# Altium schematic sheet koosh_mcu.SchDoc
size A
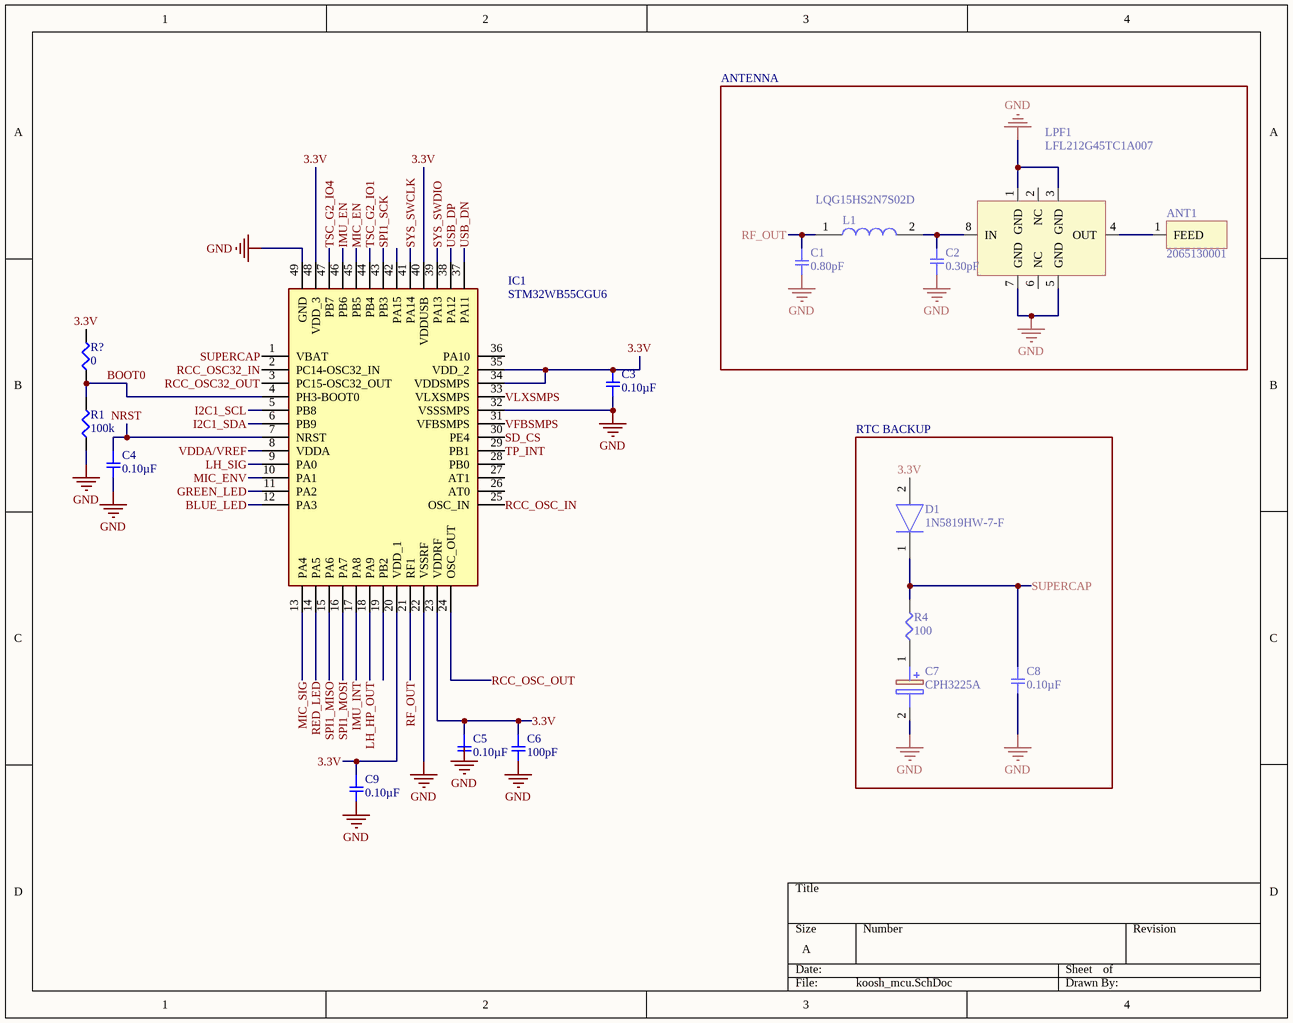
[diagram p0: koosh_mcu.SchDoc]

## Parts
ANT1  2065130001  [2065130001]
C1  0.80pF  [SMD-0402C]
C2  0.30pF  [SMD-0402C]
C3  0.10µF  [SMD-0402C]
C4  0.10µF  [SMD-0402C]
C5  0.10µF  [SMD-0402C]
C6  100pF  [SMD-0402C]
C7  CPH3225A  [CPH3225A]
C8  0.10µF  [SMD-0402C]
C9  0.10µF  [SMD-0402C]
D1  1N5819HW-7-F  [SOD3716X145N]
IC1  STM32WB55CGU6  [QFN50P700X700X65-49N-D]
L1  LQG15HS2N7S02D  [INDC1005X55N]
LPF1  LFL212G45TC1A007  [LFL212G45TC1A007]
R1  100k  [SMD-0402-RES]
R4  100  [SMD-0402-RES]
R?  0  [SMD-0402-RES]

## Blocks framed on the sheet
ANTENNA: ANT1 C1 C2 L1 LPF1
RTC BACKUP: C7 C8 D1 R4

## Nets
GND: C1.2 C2.1 C3.2 C4.2 C6.2 C7.2(-) C8.2 C9.2 IC1.22(VSSRF) IC1.32(VSSSMPS) IC1.49(GND) LPF1.1(GND) LPF1.3(GND) LPF1.5(GND) LPF1.7(GND) R1.1
3.3V: C3.1 C5.1 C6.1 C9.1 D1.2(A) IC1.20(VDD_1) IC1.23(VDDRF) IC1.34(VDDSMPS) IC1.35(VDD_2) IC1.40(VDDUSB) IC1.48(VDD_3) R?.2
BLUE_LED: IC1.12(PA3)
BOOT0: IC1.4(PH3-BOOT0) R1.2 R?.1
GREEN_LED: IC1.11(PA2)
I2C1_SCL: IC1.5(PB8)
I2C1_SDA: IC1.6(PB9)
IMU_EN: IC1.46(PB6)
IMU_INT: IC1.17(PA8)
LH_HP_OUT: IC1.18(PA9)
LH_SIG: IC1.9(PA0)
MIC_EN: IC1.45(PB5)
MIC_ENV: IC1.10(PA1)
MIC_SIG: IC1.13(PA4)
NRST: C4.1 IC1.7(NRST)
RCC_OSC32_IN: IC1.2(PC14-OSC32_IN)
RCC_OSC32_OUT: IC1.3(PC15-OSC32_OUT)
RCC_OSC_IN: IC1.25(OSC_IN)
RCC_OSC_OUT: IC1.24(OSC_OUT)
RED_LED: IC1.14(PA5)
RF_OUT: C1.1 IC1.21(RF1) L1.1
SD_CS: IC1.30(PE4)
SPI1_MISO: IC1.15(PA6)
SPI1_MOSI: IC1.16(PA7)
SPI1_SCK: IC1.43(PB3)
SUPERCAP: C8.1 D1.1(K) IC1.1(VBAT) R4.2
SYS_SWCLK: IC1.41(PA14)
SYS_SWDIO: IC1.39(PA13)
TP_INT: IC1.29(PB1)
TSC_G2_IO1: IC1.44(PB4)
TSC_G2_IO4: IC1.47(PB7)
USB_DN: IC1.37(PA11)
USB_DP: IC1.38(PA12)
VDDA/VREF: IC1.8(VDDA)
VFBSMPS: IC1.31(VFBSMPS)
VLXSMPS: IC1.33(VLXSMPS)
NetANT1_1: ANT1.1(FEED) LPF1.4(OUT)
NetC2_2: C2.2 L1.2 LPF1.8(IN)
NetC7_1: C7.1(+) R4.1

Not connected (* = marked no-connect by the designer): C5 2; IC1 19(PB2) 26(AT0) 27(AT1) 28(PB0) 36(PA10) 42(PA15); LPF1 2(NC) 6(NC)

## Notes on the sheet
- Labels drawn without touching a wire or pin: GND

## Library data of the parts
C1 = GRM1555C1HR80BA01D: CAP CER 0.8PF 50V NP0 0402; Manufacturer: Murata Electronics North America; Factory Stock: 0; Unit Price (USD): 0.1; Minimum Quantity: 1; Tolerance: ±0.1pF; Temperature Coefficient: C0G, NP0; Datasheets: http://www.murata.com/~/media/webrenewal/support/library/catalog/products/capacitor/mlcc/c02e.pdf; Image: //media.digikey.com/Renders/Murata%20Renders/ZRB-SERIES-0402.jpg; Digi-Key Part Number: 490-6269-1-ND; Part Number: GRM1555C1HR80BA01D; Quantity Available: 38847; @ qty: 0; Packaging: Cut Tape (CT); Series: GRM; Part Status: Active; Value: 0.80pF; Voltage: 50V; Operating Temperature: -55°C ~ 125°C; Features: -; Ratings: -; Applications: General Purpose; Mounting Type: Surface Mount, MLCC; Package / Case: 0402 (1005 Metric); Size / Dimension: 0.039" L x 0.020" W (1.00mm x 0.50mm); Height - Seated (Max): -; Thickness (Max): 0.022" (0.55mm); Lead Spacing: -; Lead Style: -
C2 = GRM1555C1HR30WA01D: CAP CER 0.3PF 50V NP0 0402; Manufacturer: Murata Electronics North America; Factory Stock: 0; Unit Price (USD): 0.16; Minimum Quantity: 1; Tolerance: ±0.05pF; Temperature Coefficient: C0G, NP0; Datasheets: http://www.murata.com/~/media/webrenewal/support/library/catalog/products/capacitor/mlcc/c02e.pdf; Image: //media.digikey.com/Renders/Murata%20Renders/ZRB-SERIES-0402.jpg; Digi-Key Part Number: 490-6261-1-ND; Part Number: GRM1555C1HR30WA01D; Quantity Available: 61475; @ qty: 0; Packaging: Cut Tape (CT); Series: GRM; Part Status: Active; Value: 0.30pF; Voltage: 50V; Operating Temperature: -55°C ~ 125°C; Features: -; Ratings: -; Applications: General Purpose; Mounting Type: Surface Mount, MLCC; Package / Case: 0402 (1005 Metric); Size / Dimension: 0.039" L x 0.020" W (1.00mm x 0.50mm); Height - Seated (Max): -; Thickness (Max): 0.022" (0.55mm); Lead Spacing: -; Lead Style: -
C3-C5 C8 C9 = GCM155R71C104KA55D: CAP CER 0.1UF 16V X7R 0402; Manufacturer: Murata Electronics North America; Factory Stock: 0; Unit Price (USD): 0.1; Minimum Quantity: 1; Tolerance: ±10%; Datasheets: http://www.murata.com/~/media/webrenewal/support/library/catalog/products/capacitor/mlcc/c03e.ashx; Image: //media.digikey.com/Renders/Murata%20Renders/ZRB-SERIES-0402.jpg; Digi-Key Part Number: 490-4759-1-ND; Part Number: GCM155R71C104KA55D; Quantity Available: 734194; @ qty: 0; Packaging: Cut Tape (CT); Series: GCM; Part Status: Active; Value: 0.10µF; Voltage: 16V; Temperature Coefficient: X7R; Operating Temperature: -55°C ~ 125°C; Features: -; Ratings: AEC-Q200; Applications: Automotive; Mounting Type: Surface Mount, MLCC; Package / Case: 0402 (1005 Metric); Size / Dimension: 0.039" L x 0.020" W (1.00mm x 0.50mm); Height - Seated (Max): -; Thickness (Max): 0.022" (0.55mm); Lead Spacing: -; Lead Style: -
C6 = GCM1555C1H101JA16D: CAP CER 100PF 50V NP0 0402; Manufacturer: Murata Electronics North America; Factory Stock: 0; Unit Price (USD): 0.1; Minimum Quantity: 1; Tolerance: ±5%; Temperature Coefficient: C0G, NP0; Datasheets: http://www.murata.com/~/media/webrenewal/support/library/catalog/products/capacitor/mlcc/c03e.ashx; Image: //media.digikey.com/Renders/Murata%20Renders/ZRB-SERIES-0402.jpg; Digi-Key Part Number: 490-10669-1-ND; Part Number: GCM1555C1H101JA16D; Quantity Available: 61397; @ qty: 0; Packaging: Cut Tape (CT); Series: GCM; Part Status: Active; Value: 100pF; Voltage: 50V; Operating Temperature: -55°C ~ 125°C; Features: -; Ratings: AEC-Q200; Applications: Automotive; Mounting Type: Surface Mount, MLCC; Package / Case: 0402 (1005 Metric); Size / Dimension: 0.039" L x 0.020" W (1.00mm x 0.50mm); Height - Seated (Max): -; Thickness (Max): 0.022" (0.55mm); Lead Spacing: -; Lead Style: -
C7 = CPH3225A: Capacitor Polarised; Manufacturer_Name: Seiko Instruments Micro Energy; Datasheet Link: https://www.sii.co.jp/en/me/datasheets/chip-capacitor/cph3225a/; Height: 1mm; Manufacturer_Part_Number: CPH3225A; Mouser Part Number: 628-CPH3225A; Mouser Price/Stock: https://www.mouser.com/Search/Refine.aspx?Keyword=628-CPH3225A
D1 = 1N5819HW-7-F: Diode; Manufacturer_Name: Diodes Inc.; Allied_Number: 70437201; Datasheet Link: http://www.diodes.com/_files/datasheets/ds30217.pdf; Height: 1.45mm; Manufacturer_Part_Number: 1N5819HW-7-F; Mouser Part Number: 621-1N5819HW-F; Mouser Price/Stock: https://www.mouser.com/Search/Refine.aspx?Keyword=621-1N5819HW-F; RS Part Number: 7082197P; RS Price/Stock: http://uk.rs-online.com/web/p/products/7082197P; Allied Price/Stock: http://www.alliedelec.com/diodes-inc-1n5819hw-7-f/70437201/
IC1 = STM32WB55CGU6: Integrated Circuit; Manufacturer_Name: STMicroelectronics; Datasheet Link: https://www.st.com/en/microcontrollers/stm32wb55cg.html; Height: 0.65mm; Manufacturer_Part_Number: STM32WB55CGU6; Mouser Part Number: 511-STM32WB55CGU6; Mouser Price/Stock: https://www.mouser.com/Search/Refine.aspx?Keyword=511-STM32WB55CGU6
L1 = LQG15HS2N7S02D: Inductor; Manufacturer_Name: Murata Electronics; Datasheet Link: https://www.arrow.com/en/products/lqg15hs2n7s02d/murata-manufacturing; Height: 0.55mm; Manufacturer_Part_Number: LQG15HS2N7S02D
R1 = ERJ-2RKF1003X: RES SMD 100K OHM 1% 1/10W 0402; Manufacturer: Panasonic Electronic Components; Factory Stock: 0; Unit Price (USD): 0.00496; @ qty: 1500; Minimum Quantity: 1; Power (Watts): 0.1W, 1/10W; Temperature Coefficient: ±100ppm/°C; Part Number: ERJ-2RKF1003X; Datasheets: http://industrial.panasonic.com/www-cgi/jvcr13pz.cgi?E+PZ+3+AOA0002+ERJ2RKF1003X+7+WW; Image: //media.digikey.com/Photos/Panasonic%20Photos/ERJ-PA2-Series.jpg; Digi-Key Part Number: P100KLCT-ND; Quantity Available: 2645965; Packaging: Cut Tape (CT); Series: ERJ; Part Status: Active; Value: 100k; Tolerance: ±1%; Composition: Thick Film; Features: Automotive AEC-Q200; Operating Temperature: -55°C ~ 155°C; Package / Case: 0402 (1005 Metric); Supplier Device Package: 0402; Size / Dimension: 0.039" L x 0.020" W (1.00mm x 0.50mm); Height - Seated (Max): 0.016" (0.40mm); Number of Terminations: 2; Failure Rate: -
R4 = ERJ-2RKF1003X: RES SMD 100 OHM 5% 1/4W 0603; Manufacturer: Panasonic Electronic Components; Factory Stock: 0; Unit Price (USD): 0.00496; @ qty: 1500; Minimum Quantity: 1; Tolerance: ±1%; Power (Watts): 0.1W, 1/10W; Temperature Coefficient: ±100ppm/°C; Part Number: ERJ-2RKF1003X; Datasheets: http://industrial.panasonic.com/www-cgi/jvcr13pz.cgi?E+PZ+3+AOA0002+ERJ2RKF1003X+7+WW; Image: //media.digikey.com/Photos/Panasonic%20Photos/ERJ-PA2-Series.jpg; Digi-Key Part Number: P100KLCT-ND; Quantity Available: 2645965; Packaging: Cut Tape (CT); Series: ERJ; Part Status: Active; Value: 100; Composition: Thick Film; Features: Automotive AEC-Q200; Operating Temperature: -55°C ~ 155°C; Package / Case: 0603 (1608 Metric); Supplier Device Package: 0603; Size / Dimension: 0.039" L x 0.020" W (1.00mm x 0.50mm); Height - Seated (Max): 0.016" (0.40mm); Number of Terminations: 2; Failure Rate: -
R? = ERJ-2RKF1003X: RES SMD 0 OHM 1% 1/10W 0402; Manufacturer: Panasonic Electronic Components; Unit Price (USD): 0.00496; @ qty: 1500; Minimum Quantity: 1; Power (Watts): 0.1W, 1/10W; Temperature Coefficient: ±100ppm/°C; Part Number: ERJ-2RKF1003X; Datasheets: http://industrial.panasonic.com/www-cgi/jvcr13pz.cgi?E+PZ+3+AOA0002+ERJ2RKF1003X+7+WW; Image: //media.digikey.com/Photos/Panasonic%20Photos/ERJ-PA2-Series.jpg; Digi-Key Part Number: P100KLCT-ND; Quantity Available: 2645965; Factory Stock: 0; Packaging: Cut Tape (CT); Series: ERJ; Part Status: Active; Value: 0; Tolerance: ±1%; Composition: Thick Film; Features: Automotive AEC-Q200; Operating Temperature: -55°C ~ 155°C; Package / Case: 0402 (1005 Metric); Supplier Device Package: 0402; Size / Dimension: 0.039" L x 0.020" W (1.00mm x 0.50mm); Height - Seated (Max): 0.016" (0.40mm); Number of Terminations: 2; Failure Rate: -